# Altium schematic sheet USB.SchDoc
size A4; SheetNumber: 6; SheetTotal: 7
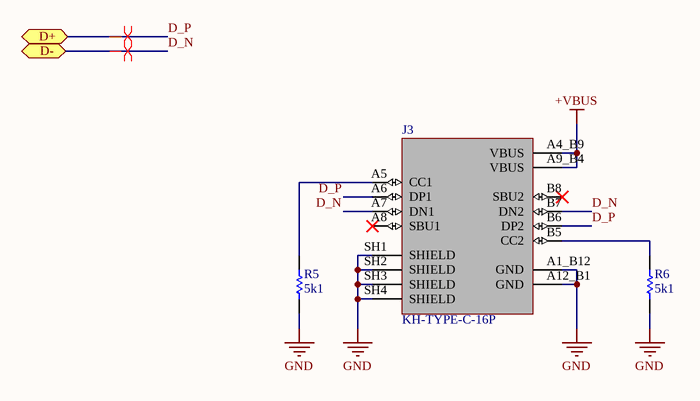
[diagram p0: USB.SchDoc]

## Parts
J3  KH-TYPE-C-16P  [KINGHELM_KH-TYPE-C-16P]
R5  value 5k1  [0805 Resistor]  (hidden comment: Generic Resistor 5k1 0805)
R6  value 5k1  [0805 Resistor]  (hidden comment: Generic Resistor 5k1 0805)

## Ports
D+ (bidir), D- (bidir)

## Nets
+VBUS: J3.A4_B9(VBUS) J3.A9_B4(VBUS)
GND: J3.A1_B12(GND) J3.A12_B1(GND) J3.SH1(SHIELD) J3.SH2(SHIELD) J3.SH3(SHIELD) J3.SH4(SHIELD) R5.1 R6.1
D_N: J3.A7(DN1) J3.B7(DN2) ; port D-
D_P: J3.A6(DP1) J3.B6(DP2) ; port D+
NetJ3_A5: J3.A5(CC1) R5.2
NetJ3_B5: J3.B5(CC2) R6.2

Not connected (* = marked no-connect by the designer): J3 A8(SBU1)* B8(SBU2)*

## Layout directives
differential pair; differential pair class USB: D_N, D_P

## Library data of the parts
J3 = KH-TYPE-C-16P: MF: kinghelm; Value: *; SnapEDA_Link: https://www.snapeda.com/parts/KH-TYPE-C-16P/Ki/view-part/?ref=snap; MP: KH-TYPE-C-16P; Check_prices: https://www.snapeda.com/parts/KH-TYPE-C-16P/Ki/view-part/?ref=eda; Availability: Not in stock; Price: None; Package: None